# Altium schematic sheet MCU_IMU.SchDoc
size A; SheetNumber: 1; SheetTotal: 3
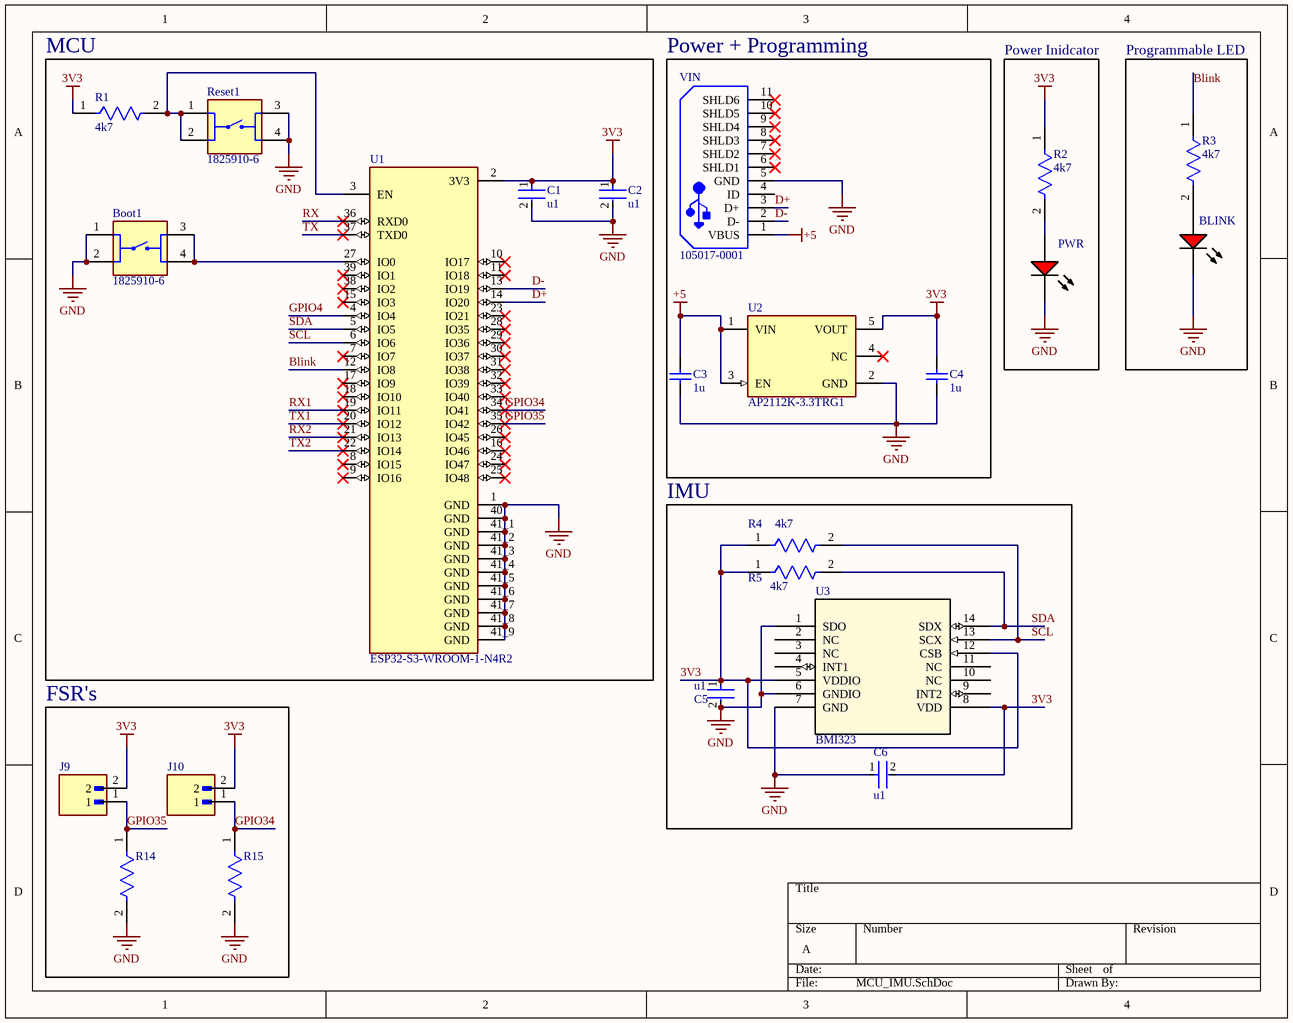
[diagram p0: MCU_IMU.SchDoc]

## Parts
BLINK  SML-LX1206IC-TR  [LUMX-SML-LX1206IC_V]  (value not drawn)
Boot1  1825910-6  [SW_1825910-6-4]
C1  u1  [FP-CC0805-0_85-MFG]
C2  u1  [FP-CC0805-0_85-MFG]
C3  1u  [CAPC2013X140X50ML20T25]
C4  1u  [CAPC2013X140X50ML20T25]
C5  u1  [FP-CC0805-0_85-MFG]
C6  u1  [FP-CC0805-0_85-MFG]
J9  M20-9990246  [HARWIN_M20-9990246]  (value not drawn)
J10  M20-9990246  [HARWIN_M20-9990246]  (value not drawn)
PWR  SML-LX1206IC-TR  [LUMX-SML-LX1206IC_V]  (value not drawn)
R1  4k7  [FP-CRCW0805-e3-IPC_B]
R2  4k7  [FP-CRCW0805-e3-IPC_B]
R3  4k7  [FP-CRCW0805-e3-IPC_B]
R4  4k7  [FP-CRCW0805-e3-IPC_B]
R5  4k7  [FP-CRCW0805-e3-IPC_B]
R14  RMCF1206FG10K0  [FP-RMCF1206-MFG]  (value not drawn)
R15  RMCF1206FG10K0  [FP-RMCF1206-MFG]  (value not drawn)
Reset1  1825910-6  [SW_1825910-6-4]
U1  ESP32-S3-WROOM-1-N4R2  [XCVR_ESP32-S3-WROOM-1-N4R2]
U2  AP2112K-3.3TRG1  [FP-SOT25-IPC_A]
U3  BMI323  [BMI323_BOS]
VIN  105017-0001  [USB-MICRO-B_V]

## Blocks framed on the sheet
MCU: Boot1 C1 C2 R1 Reset1 U1
Power + Programming: C3 C4 U2 VIN
Power Inidcator: PWR R2
Programmable LED: BLINK R3
IMU: C5 C6 R4 R5 U3
FSR's: J9 J10 R14 R15

## Nets
3V3: C1.1 C2.1 C4.2 C5.1 C6.2 J9.2 J10.2 R1.1 R2.1 R4.1 R5.1 U1.2(3V3) U2.5(VOUT) U3.5(VDDIO) U3.8(VDD) U3.12(CSB)
+5: C3.2 U2.1(VIN) U2.3(EN) VIN.1(VBUS)
GND: BLINK.2(K) Boot1.1 Boot1.2 C1.2 C2.2 C3.1 C4.1 C5.2 C6.1 PWR.2(K) R14.2 R15.2 Reset1.3 Reset1.4 U1.1(GND) U1.40(GND) U1.41_1(GND) U1.41_2(GND) U1.41_3(GND) U1.41_4(GND) U1.41_5(GND) U1.41_6(GND) U1.41_7(GND) U1.41_8(GND) U1.41_9(GND) U2.2(GND) U3.1(SDO) U3.6(GNDIO) U3.7(GND) VIN.5(GND)
Blink: R3.1 U1.12(IO8)
D+: U1.14(IO20) VIN.3(D+)
D-: U1.13(IO19) VIN.2(D-)
GPIO4: U1.4(IO4)
GPIO34: J10.1 R15.1 U1.34(IO41)
GPIO35: J9.1 R14.1 U1.35(IO42)
RX: U1.36(RXD0)
RX1: U1.19(IO11)
RX2: U1.21(IO13)
SCL: R4.2 U1.6(IO6) U3.13(SCX)
SDA: R5.2 U1.5(IO5) U3.14(SDX)
TX: U1.37(TXD0)
TX1: U1.20(IO12)
TX2: U1.22(IO14)
NetBLINK_1: BLINK.1(A) R3.2
NetBoot1_3: Boot1.3 Boot1.4 U1.27(IO0)
NetPWR_1: PWR.1(A) R2.2
NetR1_2: R1.2 Reset1.1 Reset1.2 U1.3(EN)

Not connected (* = marked no-connect by the designer): U1 7(IO7)* 8(IO15)* 9(IO16)* 10(IO17)* 11(IO18)* 15(IO3)* 16(IO46)* 17(IO9)* 18(IO10)* 23(IO21)* 24(IO47)* 25(IO48)* 26(IO45)* 28(IO35)* 29(IO36)* 30(IO37)* 31(IO38)* 32(IO39)* 33(IO40)* 38(IO2)* 39(IO1)*; U2 4(NC)*; U3 2(NC) 3(NC) 4(INT1) 9(INT2) 10(NC) 11(NC); VIN 4(ID) 6(SHLD1)* 7(SHLD2)* 8(SHLD3)* 9(SHLD4)* 10(SHLD5)* 11(SHLD6)*

## Library data of the parts
BLINK PWR = CMP-2000-07123-1: LED Red, 65 mW, -40 to 85 degC, 2-Pin SMD, RoHS, Tape and Reel; Manufacturer: Lumex; LED Material: GaAsP; Peak Wavelength: 635nm; Number of LEDs: 1; Viewing Angle: 160; Reverse Voltage: 5(Min)V; Lens Appearance: ColorlessNonDiffused; Intensity: 6mcd; Pin_Count: 2; Lens Dimensions: 2x1.6x0.5mm; Mounting: SurfaceMount; ECCN: EAR99; RoHS: Unknown; Package Description: 2-Pin Surface Mount Device, Body 3.2 x 1.5 mm; Mounting Technology: SurfaceMount; Dominant Wavelength: N/A; Supplier_Package: SMD; Supplier Standard Pack: 3,000; Color: Red; Dimension: 3.2x1.6x1.1mm; HTS: 8541402000; Part No: SML-LX1206IC-TR; Family: SML-LX1206IC; Supplier: Lumex; Datasheet URL: http://www.lumex.com/content/files/ProductAttachment/SML-LX1206IC-TR.pdf; Package Reference: SML-LX1206IC; Manufacturer URL: http://www.lumexinstruments.com/; Type: Uni-Color; Operating Temperature: -25to85C; Packaging: TapeandReel; Datasheet Version: Rev. J, 08/2012
Boot1 Reset1 = 1825910-6: Switch Push Button OFF (ON) SPST Round Button 0.05A 24VDC Momentary Contact PC Pins Thru-Hole; MF: TE Connectivity; Value: *; MP: 1825910-6; Package: None; Check_prices: https://www.snapeda.com/parts/1825910-6/TE+Connectivity+ALCOSWITCH+Switches/view-part/?ref=eda; SnapEDA_Link: https://www.snapeda.com/parts/1825910-6/TE+Connectivity+ALCOSWITCH+Switches/view-part/?ref=snap; Digi-Key_Part_Number: 450-1650-ND; Purchase-URL: https://pricing.snapeda.com/search/part/1825910-6/?ref=eda
C1 C2 C5 C6 = CMP-2100-03606-3: CC0805KRX7R9BB104 CAP CER 0.1UF 50V X7R 0805; Manufacturer: Yageo; Tolerance: 0.1; Capacitance: 100 nF; Value: 100 nF; Material: Ceramic; Device Class L1: Passive Components; ComponentLink2Description: Datasheet; Package: CC0805-0.85; Manufacturer Part Number: CC0805KRX7R9BB104; Digikey Description: CAP CER 0.1UF 50V X7R 0805; Device Class L3: Ceramic Capacitors; Temperature: -30°C to +85°C; Temperature Characteristic: X7R; Voltage Rating: 50 V; Height: 0.95mm; RoHS: TRUE; Ipc Land Pattern Name: CAPC200125X85; Device Class L2: Capacitors; Category: Cap; Temperature Range Low: -30°C; Temperature Range High: +85°C; Mouser Description: Multilayer Ceramic Capacitors MLCC - SMD/SMT 100nF 50V X7R 10%; Footprint Url: http://www.yageo.com/exep/pages/download/literatures/UPY-C_GEN_24.pdf; Automotive: No; Octopart: https://octopart.com/cc0805krx7r9bb104-yageo-192993; Lead Free: Yes; ComponentLink2URL: http://www.yageo.com/documents/recent/UPY-GPHC_Y5V_6.3V-to-50V_8.pdf
C3 C4 = CMP-2007-03236-1: Manufacturer: Kemet; Part Number: C0805C105K5RACTU
J9 J10 = CMP-002-00071-1: 2.54mm (0.1) Pitch SIL Vertical Throughboard Pin Header, 6.1mm mating pin height, tin, 2 contacts; MF: Harwin; SnapEDA_Link: https://www.snapeda.com/parts/M20-9990246/Harwin/view-part/?ref=snap; Pins: 2; Check_prices: https://www.snapeda.com/parts/M20-9990246/Harwin/view-part/?ref=eda; Component Type: Standard; Design Item ID: M20-9990246; Case/Package: None; Source: M20-9990246.SchLib; Value: *; MP: M20-9990246
R1-R5 = CMP-2100-03615-2: CRCW08054K70FKEARES Thick Film, 4.7kΩ, 1%, 0.125W, 100ppm/°C, 0805; Max Power Dissipation: 125mW; Resistance: 4.7kR; Voltage Rating: 150V; Termination: SMD/SMT; Weight: 0.000194oz; Case/Package: 0805; Number of Terminations: 2; Min Operating Temperature: -55°C; Case Code (Metric): 2012; Package Quantity: 10; Depth: 1.25mm; Military Standard: Not; Composition: Thick Film; Radiation Hardening: No; Contact Plating: Tin; Height: 0.45mm; Power Rating: 125mW; Features: Automotive AEC-Q200; Tolerance: 1%; Packaging: Tape and Reel; Max Operating Temperature: 155°C; Length: 2mm; Case Code (Imperial): 0805; Voltage Rating (DC): 150V; Width: 1.25mm; Temperature Coefficient: 100ppm/°C; Lead Free: Lead Free
R14 R15 = CMP-26527-002036-1: 10kΩ ±1% 0.25W 1206 Thick Film Chip Resistor AEC-Q200 compliant; Max Power Dissipation: 250mW; Resistance: 10kR; Temperature Coefficient: 100ppm/°C; Construction: Rectangular; Contact Plating: Tin; Max Operating Temperature: 155°C; Features: Automotive AEC-Q200; Radiation Hardening: No; Military Standard: Not; RoHS Compliant: Yes; Length: 0.126inch; Number of Terminations: 2; Mount: Surface Mount; Case Code (Imperial): 1206; Case Code (Metric): 3216; Series: RMCF; Width: 0.063inch; Min Operating Temperature: -55°C; Height: 0.028inch; Resistor Type: Thick Film; Packaging: Tape and Reel; Tolerance: 1%; Depth: 1.6mm; Case/Package: 1206
U1 = ESP32-S3-WROOM-1-N4R2: Bluetooth, WiFi 802.11b/g/n, Bluetooth v5.0 Transceiver Module 2.4GHz PCB Trace Surface Mount; MF: Espressif Systems; Package: None; Purchase-URL: https://pricing.snapeda.com/search/part/ESP32-S3-WROOM-1-N4R2/?ref=eda; Price: None; Availability: In Stock; Check_prices: https://www.snapeda.com/parts/ESP32-S3-WROOM-1-N4R2/Espressif+Systems/view-part/?ref=eda; MP: ESP32-S3-WROOM-1-N4R2; SnapEDA_Link: https://www.snapeda.com/parts/ESP32-S3-WROOM-1-N4R2/Espressif+Systems/view-part/?ref=snap; Value: *
U2 = CMP-12756-000035-1: IC REG LINEAR 3.3V 600MA SOT25; Number of Regulators: 1; Output Type: Fixed; Polarity: Positive; Min Input Voltage: 2.5V; Max Input Voltage: 6V; Accuracy: 1.5%; Quiescent Current: 55uA; Dropout Voltage: 250mV; Min Operating Temperature: -40°C; Length: 3.1mm; Output Current: 600mA; Max Operating Temperature: 85°C; Package Quantity: 1; Output Voltage: 3.3V; Width: 1.7mm; Number of Outputs: 1; Packaging: Tape and Reel; Height: 1.3mm; Lead Free: Lead Free; Max Output Current: 600mA; Case/Package: SOT-23-5; Mount: Surface Mount; Number of Pins: 5
U3 = BMI323: No Description Available; Manufacturer_Name: Bosch Sensortec; Copyright: Copyright (C) 2025 Ultra Librarian. All rights reserved.; Manufacturer_Part_Number: BMI323; RefDes: RefDes; Type: Type
VIN = CMP-2000-05827-1: Micro-USB B Receptacle, Right Angle, Bottom Mount, Surface Mount, with Solder Tabs, -30 to 85 degC, 5-Pin USB, RoHS, Tape and Reel; Manufacturer: Molex; Featured Product: Micro-USBConnectorsUSBConnectors; Other Names: WM1399DKR; Package Version: Rev. F, 12/2012; Number of Contacts: 5; Connector Type: USB-microB; Catalog Drawings: 1050170001; 3D Model: 105017-0001.stp; Mating Products: WM17145-ND-CABLEMICROUSBBTOSTDA1.0MWM17147-ND-CABLEMICROUSBBTOSTDA2.0MWM17146-ND-CABLEMICROUSBBTOSTDA1.5M; PCN Assembly/Origin: ResinSupplier21/Oct/2015; Voltage - Max: 30V; Online Catalog: Molex-MicroUSB; Manufacturer URL: http://www.molex.com/; Package Description: 5-Leads USB, Micro B, Body 7.5 x 5 mm, Pitch 0.65 mm; Datasheet URL: http://www.molex.com/elqNow/elqRedir.htm?ref=http://www.molex.com/webdocs/datasheets/pdf/en-us/1050170001_IO_CONNECTORS.pdf; Ingress Protection: -; Datasheet Version: 03/2016; Mounting Type: BoardCutout,SurfaceMount,RightAngle; Circuits: 5; Standard Package: 1; Package Reference: MICRO-B; Package URL: http://www.molex.com/pdm_docs/sd/1050170001_sd.pdf; Category: Connectors,Interconnects; Series: -; RoHS Information: 1050170001CertofCompliance; Features: Shielded,SolderRetention; Family: USB,DVI,HDMIConnectors; Specifications: -; Gender: Receptacle; Packaging: Digi-Reel®; Mounting Technology: SurfaceMount